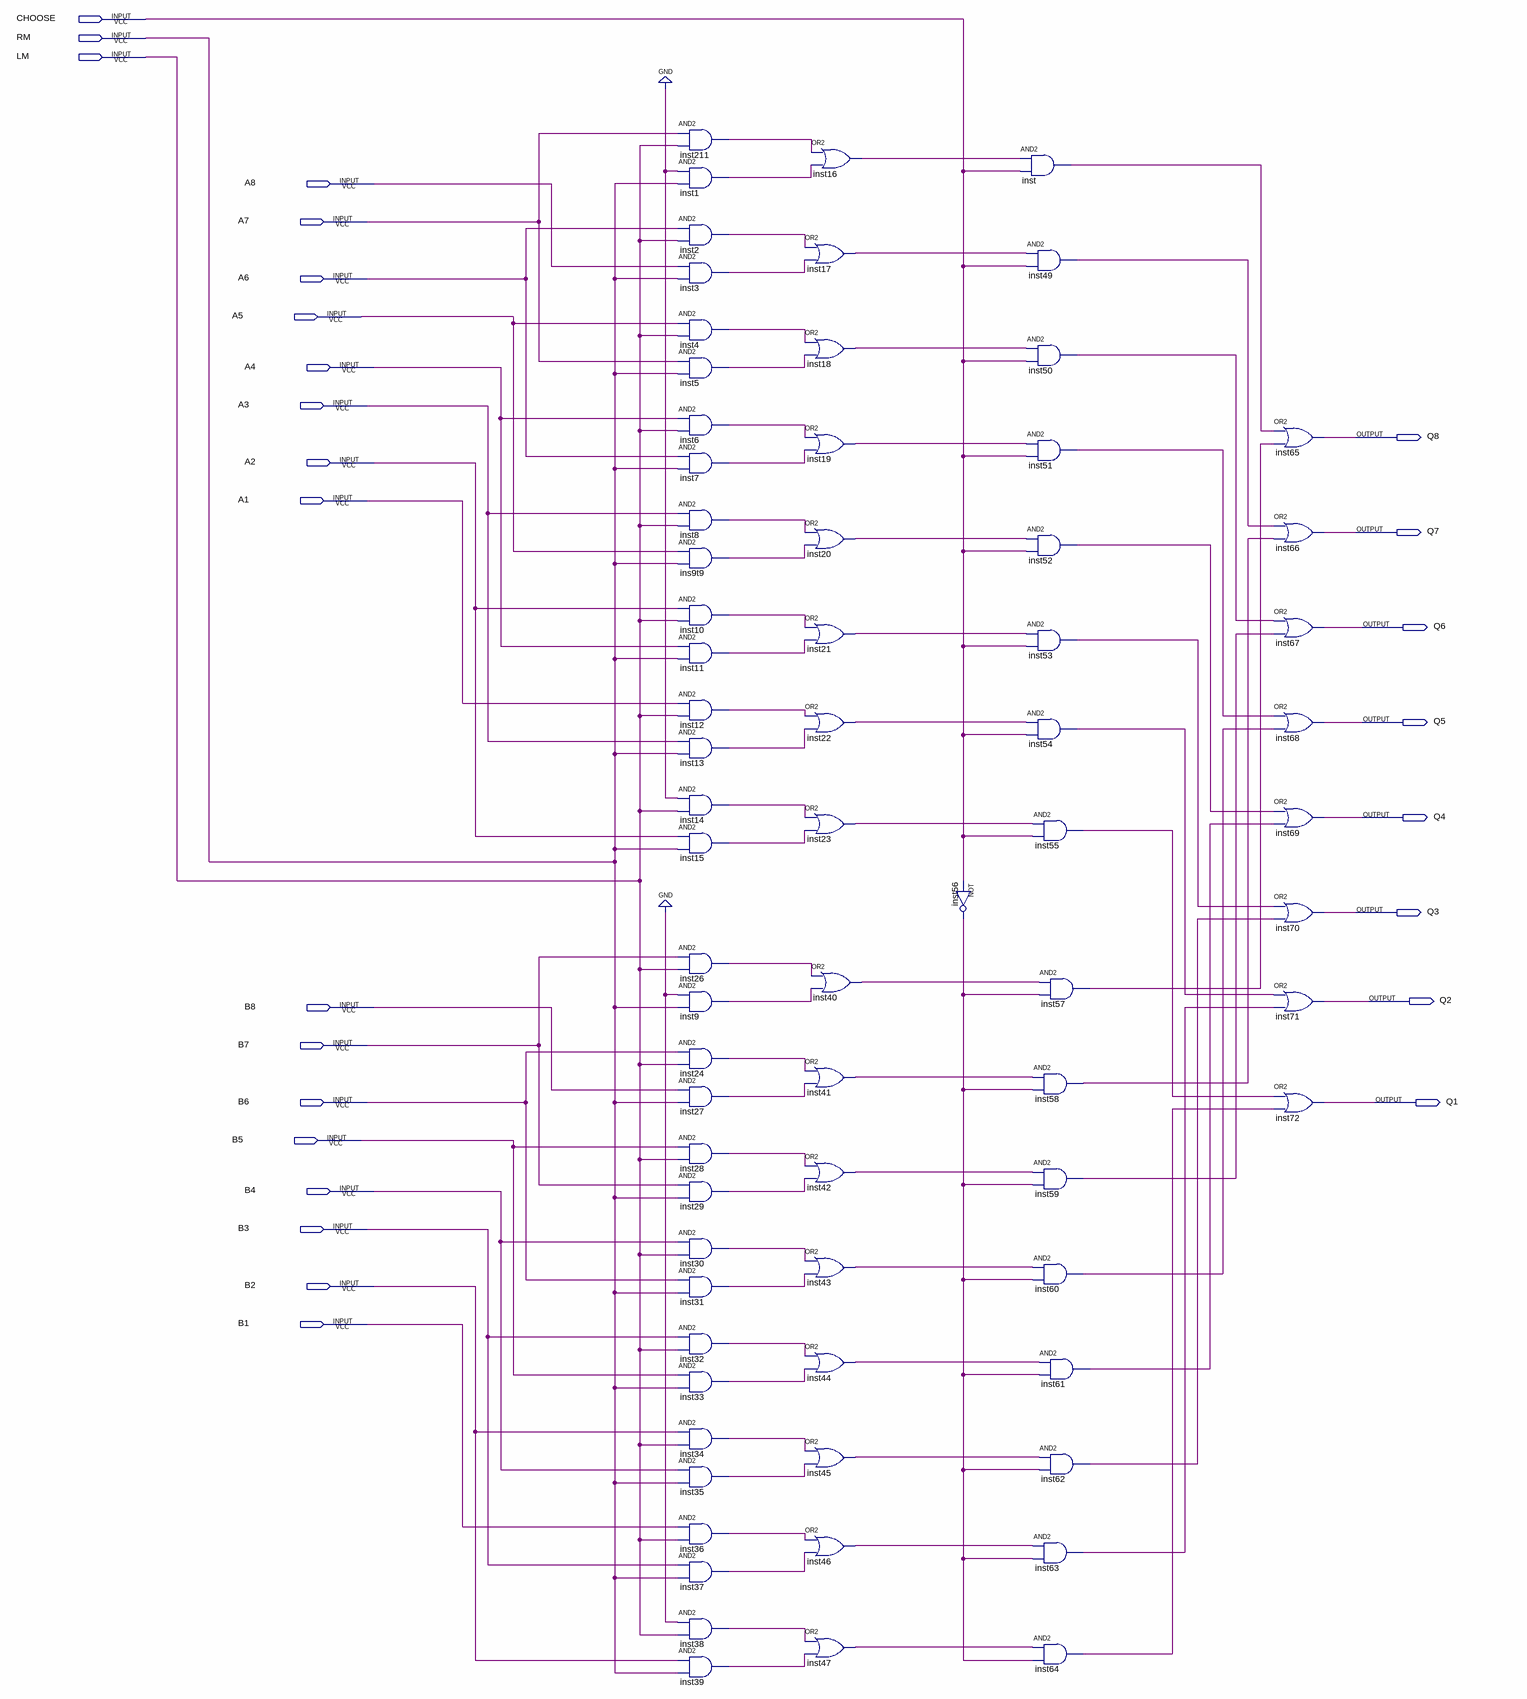
[diagram p0: schematic sheet]
// Quartus schematic shift.bdf as structural Verilog: 73 symbols, 27 pins
module shift (
  input  CHOOSE,
  input  RM,
  input  LM,
  input  A8,
  input  A7,
  input  A6,
  input  A5,
  input  A4,
  input  A3,
  input  A2,
  input  A1,
  input  B8,
  input  B7,
  input  B6,
  input  B5,
  input  B4,
  input  B3,
  input  B2,
  input  B1,
  output Q8,
  output Q7,
  output Q6,
  output Q5,
  output Q4,
  output Q3,
  output Q2,
  output Q1
);

  wire ins9t9_out, inst1_out, inst2_out, inst3_out, inst4_out, inst5_out, inst6_out, inst7_out, inst8_out,
       inst9_out, inst10_out, inst11_out, inst12_out, inst13_out, inst14_out, inst15_out, inst16_out,
       inst17_out, inst18_out, inst19_out, inst20_out, inst21_out, inst22_out, inst23_out, inst24_out,
       inst26_out, inst27_out, inst28_out, inst29_out, inst30_out, inst31_out, inst32_out, inst33_out,
       inst34_out, inst35_out, inst36_out, inst37_out, inst38_out, inst39_out, inst40_out, inst41_out,
       inst42_out, inst43_out, inst44_out, inst45_out, inst46_out, inst47_out, inst49_out, inst50_out,
       inst51_out, inst52_out, inst53_out, inst54_out, inst55_out, inst56_out, inst57_out, inst58_out,
       inst59_out, inst60_out, inst61_out, inst62_out, inst63_out, inst64_out, inst211_out, inst_out;

  and inst211 (inst211_out, A7, LM);
  and inst1 (inst1_out, 1'b0, RM);
  and inst2 (inst2_out, A6, LM);
  and inst3 (inst3_out, A8, RM);
  and inst4 (inst4_out, A5, LM);
  and inst5 (inst5_out, A7, RM);
  and inst6 (inst6_out, A4, LM);
  and inst7 (inst7_out, A6, RM);
  and inst8 (inst8_out, A3, LM);
  and ins9t9 (ins9t9_out, A5, RM);
  and inst10 (inst10_out, A2, LM);
  and inst11 (inst11_out, A4, RM);
  and inst12 (inst12_out, A1, LM);
  and inst13 (inst13_out, A3, RM);
  and inst14 (inst14_out, 1'b0, LM);
  and inst15 (inst15_out, A2, RM);
  and inst26 (inst26_out, B7, LM);
  and inst9 (inst9_out, 1'b0, RM);
  and inst24 (inst24_out, B6, LM);
  and inst27 (inst27_out, B8, RM);
  and inst28 (inst28_out, B5, LM);
  and inst29 (inst29_out, B7, RM);
  and inst30 (inst30_out, B4, LM);
  and inst31 (inst31_out, B6, RM);
  and inst32 (inst32_out, B3, LM);
  and inst33 (inst33_out, B5, RM);
  and inst34 (inst34_out, B2, LM);
  and inst35 (inst35_out, B4, RM);
  and inst36 (inst36_out, B1, LM);
  and inst37 (inst37_out, B3, RM);
  and inst38 (inst38_out, 1'b0, LM);
  and inst39 (inst39_out, B2, RM);
  or inst16 (inst16_out, inst211_out, inst1_out);
  or inst17 (inst17_out, inst2_out, inst3_out);
  or inst18 (inst18_out, inst4_out, inst5_out);
  or inst19 (inst19_out, inst6_out, inst7_out);
  or inst20 (inst20_out, inst8_out, ins9t9_out);
  or inst21 (inst21_out, inst10_out, inst11_out);
  or inst22 (inst22_out, inst12_out, inst13_out);
  or inst23 (inst23_out, inst14_out, inst15_out);
  or inst40 (inst40_out, inst26_out, inst9_out);
  or inst41 (inst41_out, inst24_out, inst27_out);
  or inst42 (inst42_out, inst28_out, inst29_out);
  or inst43 (inst43_out, inst30_out, inst31_out);
  or inst44 (inst44_out, inst32_out, inst33_out);
  or inst45 (inst45_out, inst34_out, inst35_out);
  or inst46 (inst46_out, inst36_out, inst37_out);
  or inst47 (inst47_out, inst38_out, inst39_out);
  not inst56 (inst56_out, CHOOSE);
  and inst (inst_out, inst16_out, CHOOSE);
  and inst49 (inst49_out, inst17_out, CHOOSE);
  and inst50 (inst50_out, inst18_out, CHOOSE);
  and inst51 (inst51_out, inst19_out, CHOOSE);
  and inst52 (inst52_out, inst20_out, CHOOSE);
  and inst53 (inst53_out, inst21_out, CHOOSE);
  and inst54 (inst54_out, inst22_out, CHOOSE);
  and inst55 (inst55_out, inst23_out, CHOOSE);
  and inst57 (inst57_out, inst40_out, inst56_out);
  and inst58 (inst58_out, inst41_out, inst56_out);
  and inst59 (inst59_out, inst42_out, inst56_out);
  and inst60 (inst60_out, inst43_out, inst56_out);
  and inst61 (inst61_out, inst44_out, inst56_out);
  and inst62 (inst62_out, inst45_out, inst56_out);
  and inst63 (inst63_out, inst46_out, inst56_out);
  and inst64 (inst64_out, inst47_out, inst56_out);
  or inst65 (Q8, inst_out, inst57_out);
  or inst66 (Q7, inst49_out, inst58_out);
  or inst67 (Q6, inst50_out, inst59_out);
  or inst68 (Q5, inst51_out, inst60_out);
  or inst69 (Q4, inst52_out, inst61_out);
  or inst70 (Q3, inst53_out, inst62_out);
  or inst71 (Q2, inst54_out, inst63_out);
  or inst72 (Q1, inst55_out, inst64_out);
endmodule
